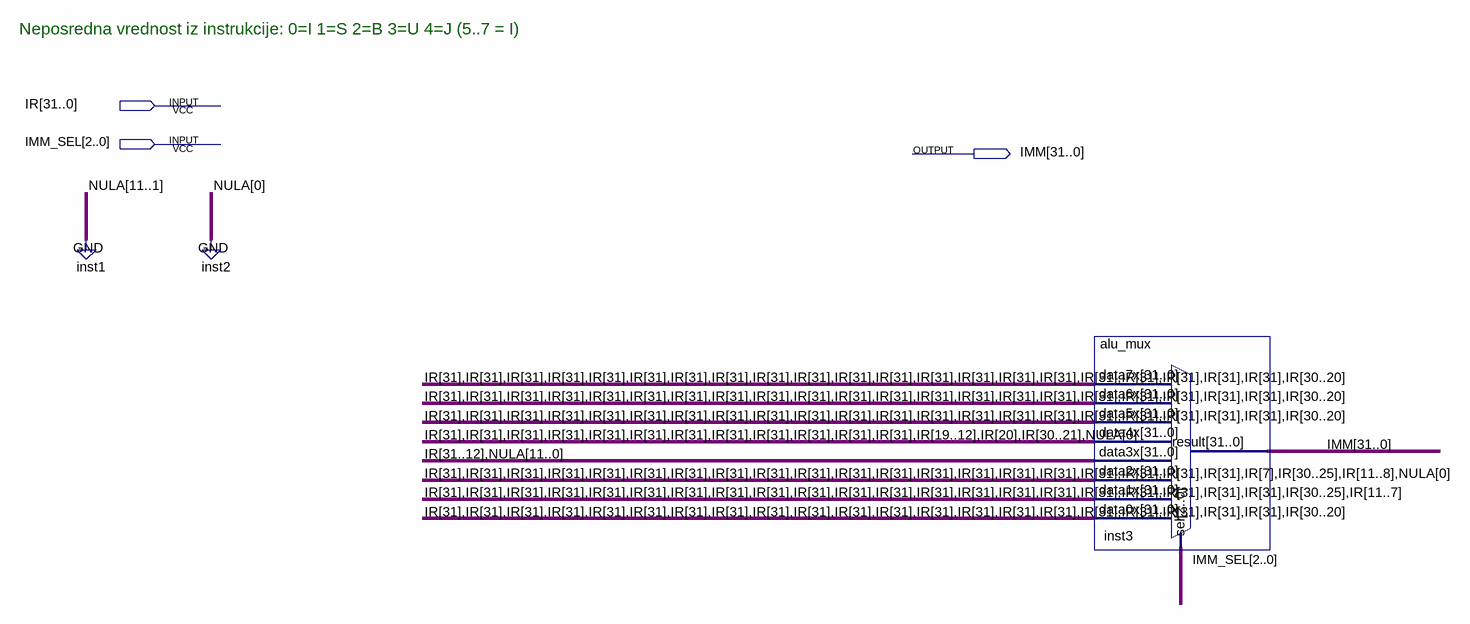
[diagram p0: schematic sheet]
// Quartus schematic imm_gen.bdf as structural Verilog: 1 symbols, 3 pins
module imm_gen (
  input  [31:0] IR,
  input  [2:0] IMM_SEL,
  output [31:0] IMM
);

  alu_mux inst3 (
    .data7x({{21{IR[31]}}, IR[30:20]}), .data6x({{21{IR[31]}}, IR[30:20]}),
    .data5x({{21{IR[31]}}, IR[30:20]}), .data4x({{12{IR[31]}}, IR[19:12], IR[20], IR[30:21], 1'b0}),
    .data3x({IR[31:12], {12{1'b0}}}), .data2x({{20{IR[31]}}, IR[7], IR[30:25], IR[11:8], 1'b0}),
    .data1x({{21{IR[31]}}, IR[30:25], IR[11:7]}), .data0x({{21{IR[31]}}, IR[30:20]}), .sel(IMM_SEL),
    .result(IMM));

  // Notes on the sheet:
  //   Neposredna vrednost iz instrukcije: 0=I 1=S 2=B 3=U 4=J (5..7 = I)
endmodule
